# EAGLE schematic Modular_RFPA_RevA (EAGLE 6.6.0)
Assembly variants: IRF520N_20W, IRF630_200W

## Sheet 1 of 4: Push-pull power stage
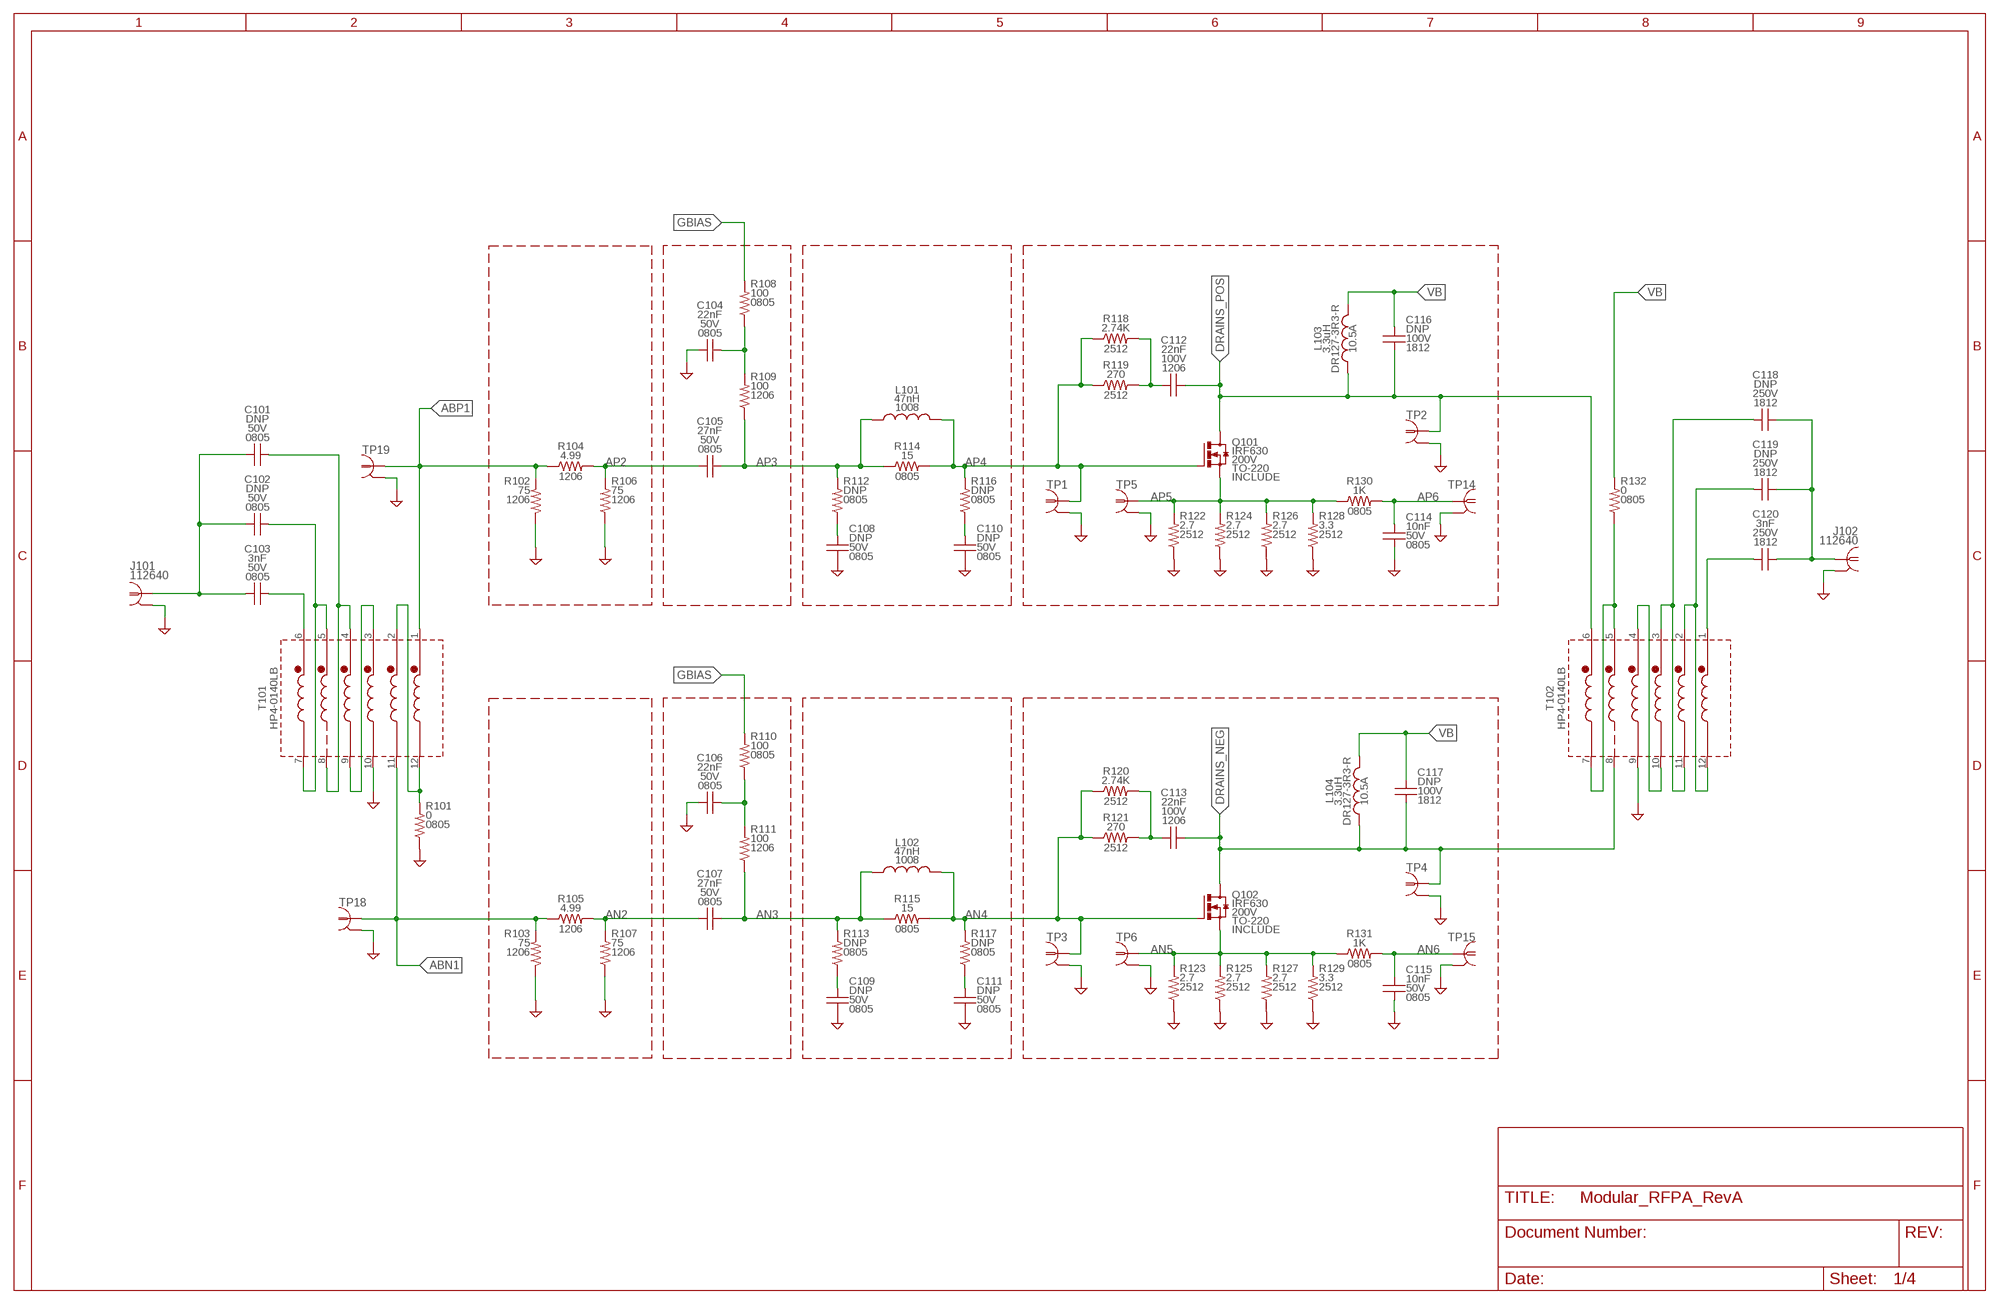
[diagram p0: schematic, sheet 1]

### Parts
C101  DNP  CGEN0805_IPC  [0805_IPC-7351B]  (not fitted in variant IRF630_200W)
C102  DNP  CGEN0805_IPC  [0805_IPC-7351B]  (not fitted in variant IRF520N_20W)  (not fitted in variant IRF630_200W)
C103  3nF  CGEN0805_IPC  [0805_IPC-7351B]  (not fitted in variant IRF520N_20W)
C104  22nF  CGEN0805_IPC  [0805_IPC-7351B]
C105  27nF  CGEN0805_IPC  [0805_IPC-7351B]
C106  22nF  CGEN0805_IPC  [0805_IPC-7351B]
C107  27nF  CGEN0805_IPC  [0805_IPC-7351B]
C108  DNP  CGEN0805_IPC  [0805_IPC-7351B]  (not fitted in variant IRF520N_20W)  (not fitted in variant IRF630_200W)
C109  DNP  CGEN0805_IPC  [0805_IPC-7351B]  (not fitted in variant IRF520N_20W)  (not fitted in variant IRF630_200W)
C110  DNP  CGEN0805_IPC  [0805_IPC-7351B]  (not fitted in variant IRF520N_20W)  (not fitted in variant IRF630_200W)
C111  DNP  CGEN0805_IPC  [0805_IPC-7351B]  (not fitted in variant IRF520N_20W)  (not fitted in variant IRF630_200W)
C112  22nF  CGENC1206  [C1206]
C113  22nF  CGENC1206  [C1206]
C114  10nF  CGEN0805_IPC  [0805_IPC-7351B]
C115  10nF  CGEN0805_IPC  [0805_IPC-7351B]
C116  DNP  CGENC1812  [C1812]
C117  DNP  CGENC1812  [C1812]
C118  DNP  CGENC1812  [C1812]  (not fitted in variant IRF630_200W)
C119  DNP  CGENC1812  [C1812]  (not fitted in variant IRF520N_20W)  (not fitted in variant IRF630_200W)
C120  3nF  CGENC1812  [C1812]  (not fitted in variant IRF520N_20W)  (variant IRF630_200W: 1.5nF)
J101  COAX112640BNC_EDGE  [BNC_EDGE]
J102  COAX112640BNC_EDGE  [BNC_EDGE]
L101  47nH  L_CHIPL-47N-AIR-5%-1008-1A1008  [L1008]
L102  47nH  L_CHIPL-47N-AIR-5%-1008-1A1008  [L1008]
L103  3.3uH  LL-3.3U-FERRITE-20%-12.5X12.5MM-10.5A  [DR127]  (variant IRF520N_20W: 22uH)
L104  3.3uH  LL-3.3U-FERRITE-20%-12.5X12.5MM-10.5A  [DR127]  (variant IRF520N_20W: 22uH)
Q101  IRF520N  MOSFET_NIRF630TO-220-VERT  [TO220BV]
Q102  IRF630  MOSFET_NIRF630TO-220-VERT  [TO220BV]
R101  0  RGEN0805_IPC  [0805_IPC-7351B]
R102  75  RGEN1206_IPC  [1206_IPC-7351B]
R103  75  RGEN1206_IPC  [1206_IPC-7351B]
R104  4.99  R90GEN1206_IPC  [1206_IPC-7351B]
R105  4.99  R90GEN1206_IPC  [1206_IPC-7351B]
R106  75  RGEN1206_IPC  [1206_IPC-7351B]
R107  75  RGEN1206_IPC  [1206_IPC-7351B]
R108  100  RGEN0805_IPC  [0805_IPC-7351B]
R109  100  RGEN1206_IPC  [1206_IPC-7351B]
R110  100  RGEN0805_IPC  [0805_IPC-7351B]
R111  100  RGEN1206_IPC  [1206_IPC-7351B]
R112  DNP  RGEN0805_IPC  [0805_IPC-7351B]  (not fitted in variant IRF520N_20W)  (not fitted in variant IRF630_200W)
R113  DNP  RGEN0805_IPC  [0805_IPC-7351B]  (not fitted in variant IRF520N_20W)  (not fitted in variant IRF630_200W)
R114  15  R90GEN0805_IPC  [0805_IPC-7351B]
R115  15  R90GEN0805_IPC  [0805_IPC-7351B]
R116  DNP  RGEN0805_IPC  [0805_IPC-7351B]  (not fitted in variant IRF520N_20W)  (not fitted in variant IRF630_200W)
R117  DNP  RGEN0805_IPC  [0805_IPC-7351B]  (not fitted in variant IRF520N_20W)  (not fitted in variant IRF630_200W)
R118  2.74K  R90GENR2512  [R2512]
R119  270  R90GENR2512  [R2512]
R120  2.74K  R90GENR2512  [R2512]
R121  270  R90GENR2512  [R2512]
R122  2.7  RGENR2512  [R2512]
R123  2.7  RGENR2512  [R2512]
R124  2.7  RGENR2512  [R2512]
R125  2.7  RGENR2512  [R2512]
R126  2.7  RGENR2512  [R2512]
R127  2.7  RGENR2512  [R2512]
R128  3.3  RGENR2512  [R2512]
R129  3.3  RGENR2512  [R2512]
R130  1K  R90GEN0805_IPC  [0805_IPC-7351B]
R131  1K  R90GEN0805_IPC  [0805_IPC-7351B]
R132  0  RGEN0805_IPC  [0805_IPC-7351B]
T101  HP4_TRAFO  [HP4]
T102  HP4_TRAFO  [HP4]
TP1  PROBE_TPTP_5MM  [PROBE_TP_5MM]
TP2  PROBE_TPTP_7P5MM  [PROBE_TP_7P5MM]
TP3  PROBE_TPTP_5MM  [PROBE_TP_5MM]
TP4  PROBE_TPTP_7P5MM  [PROBE_TP_7P5MM]
TP5  PROBE_TPTP_7P5MM  [PROBE_TP_7P5MM]
TP6  PROBE_TPTP_7P5MM  [PROBE_TP_7P5MM]
TP14  PROBE_TPTP_5MM  [PROBE_TP_5MM]
TP15  PROBE_TPTP_5MM  [PROBE_TP_5MM]
TP18  PROBE_TPTP_5MM  [PROBE_TP_5MM]
TP19  PROBE_TPTP_5MM  [PROBE_TP_5MM]

### Nets
ABN1: R103.1 R105.1 T101.11(F2) TP18.TP ; also sheet 2
ABP1: R102.1 R104.1 T101.1(S1) TP19.TP ; also sheet 2
AN2: C107.2 R105.2 R107.1
AN3: C107.1 L102.1 R111.2 R113.1 R115.1
AN4: L102.2 Q102.G R115.2 R117.1 R120.1 R121.1 TP3.TP
AN5: Q102.S R123.1 R125.1 R127.1 R129.1 R131.1 TP6.TP
AN6: C115.1 R131.2 TP15.TP
AP2: C105.2 R104.2 R106.1
AP3: C105.1 L101.1 R109.2 R112.1 R114.1
AP4: L101.2 Q101.G R114.2 R116.1 R118.1 R119.1 TP1.TP
AP5: Q101.S R122.1 R124.1 R126.1 R128.1 R130.1 TP5.TP
AP6: C114.1 R130.2 TP14.TP
DRAINS_NEG [32W_20S]: C113.2 C117.2 L104.1 Q102.D T102.8(F5) TP4.TP ; also sheet 2
DRAINS_POS [32W_30S]: C112.2 C116.2 L103.1 Q101.D T102.6(S6) TP2.TP ; also sheet 2
GBIAS: R108.1 R110.1 ; also sheet 2,3
GND: C104.2 C106.2 C108.2 C109.2 C110.2 C111.2 C114.2 C115.2 J101.G1(GND1) J101.G2(GND1) J101.G3(GND1) J101.G4(GND1) J102.G1(GND1) J102.G2(GND1) J102.G3(GND1) J102.G4(GND1) R101.2 R102.2 R103.2 R106.2 R107.2 R122.2 R123.2 R124.2 R125.2 R126.2 R127.2 R128.2 R129.2 T101.10(F3) T102.9(F4) TP1.GND(GND1) TP2.GND(GND1) TP3.GND(GND1) TP4.GND(GND1) TP5.GND(GND1) TP6.GND(GND1) TP14.GND(GND1) TP15.GND(GND1) TP18.GND(GND1) TP19.GND(GND1) ; also sheet 2,3,4
N$4: C113.1 R120.2 R121.2
N$5: C109.1 R113.2
N$8: C104.1 R108.2 R109.1
N$10: C108.1 R112.2
N$11: C110.1 R116.2
N$12: C112.1 R118.2 R119.2
N$13: C106.1 R110.2 R111.1
N$17: C111.1 R117.2
N$22: T101.3(S3) T101.9(F4)
N$27: R101.1 T101.2(S2) T101.12(F1)
N$29 [32W_30S]: C119.1 T102.2(S2) T102.12(F1)
N$30 [32W_30S]: C120.1 T102.1(S1)
N$31 [32W_30S]: C118.2 C119.2 C120.2 J102.C
N$34: C101.2 C102.2 C103.2 J101.C
N$41: C103.1 T101.6(S6)
N$52 [32W_30S]: C118.1 T102.3(S3) T102.11(F2)
N$57: C101.1 T101.4(S4) T101.8(F5)
N$58 [32W_30S]: T102.4(S4) T102.10(F3)
VB [50W_30S]: C116.1 C117.1 L103.2 L104.2 R132.1 ; also sheet 4
VB_CT [32W_30S]: R132.2 T102.5(S5) T102.7(F6)
VB_CT1: C102.1 T101.5(S5) T101.7(F6)

## Sheet 2 of 4: Parallel copy of push-pull power stage
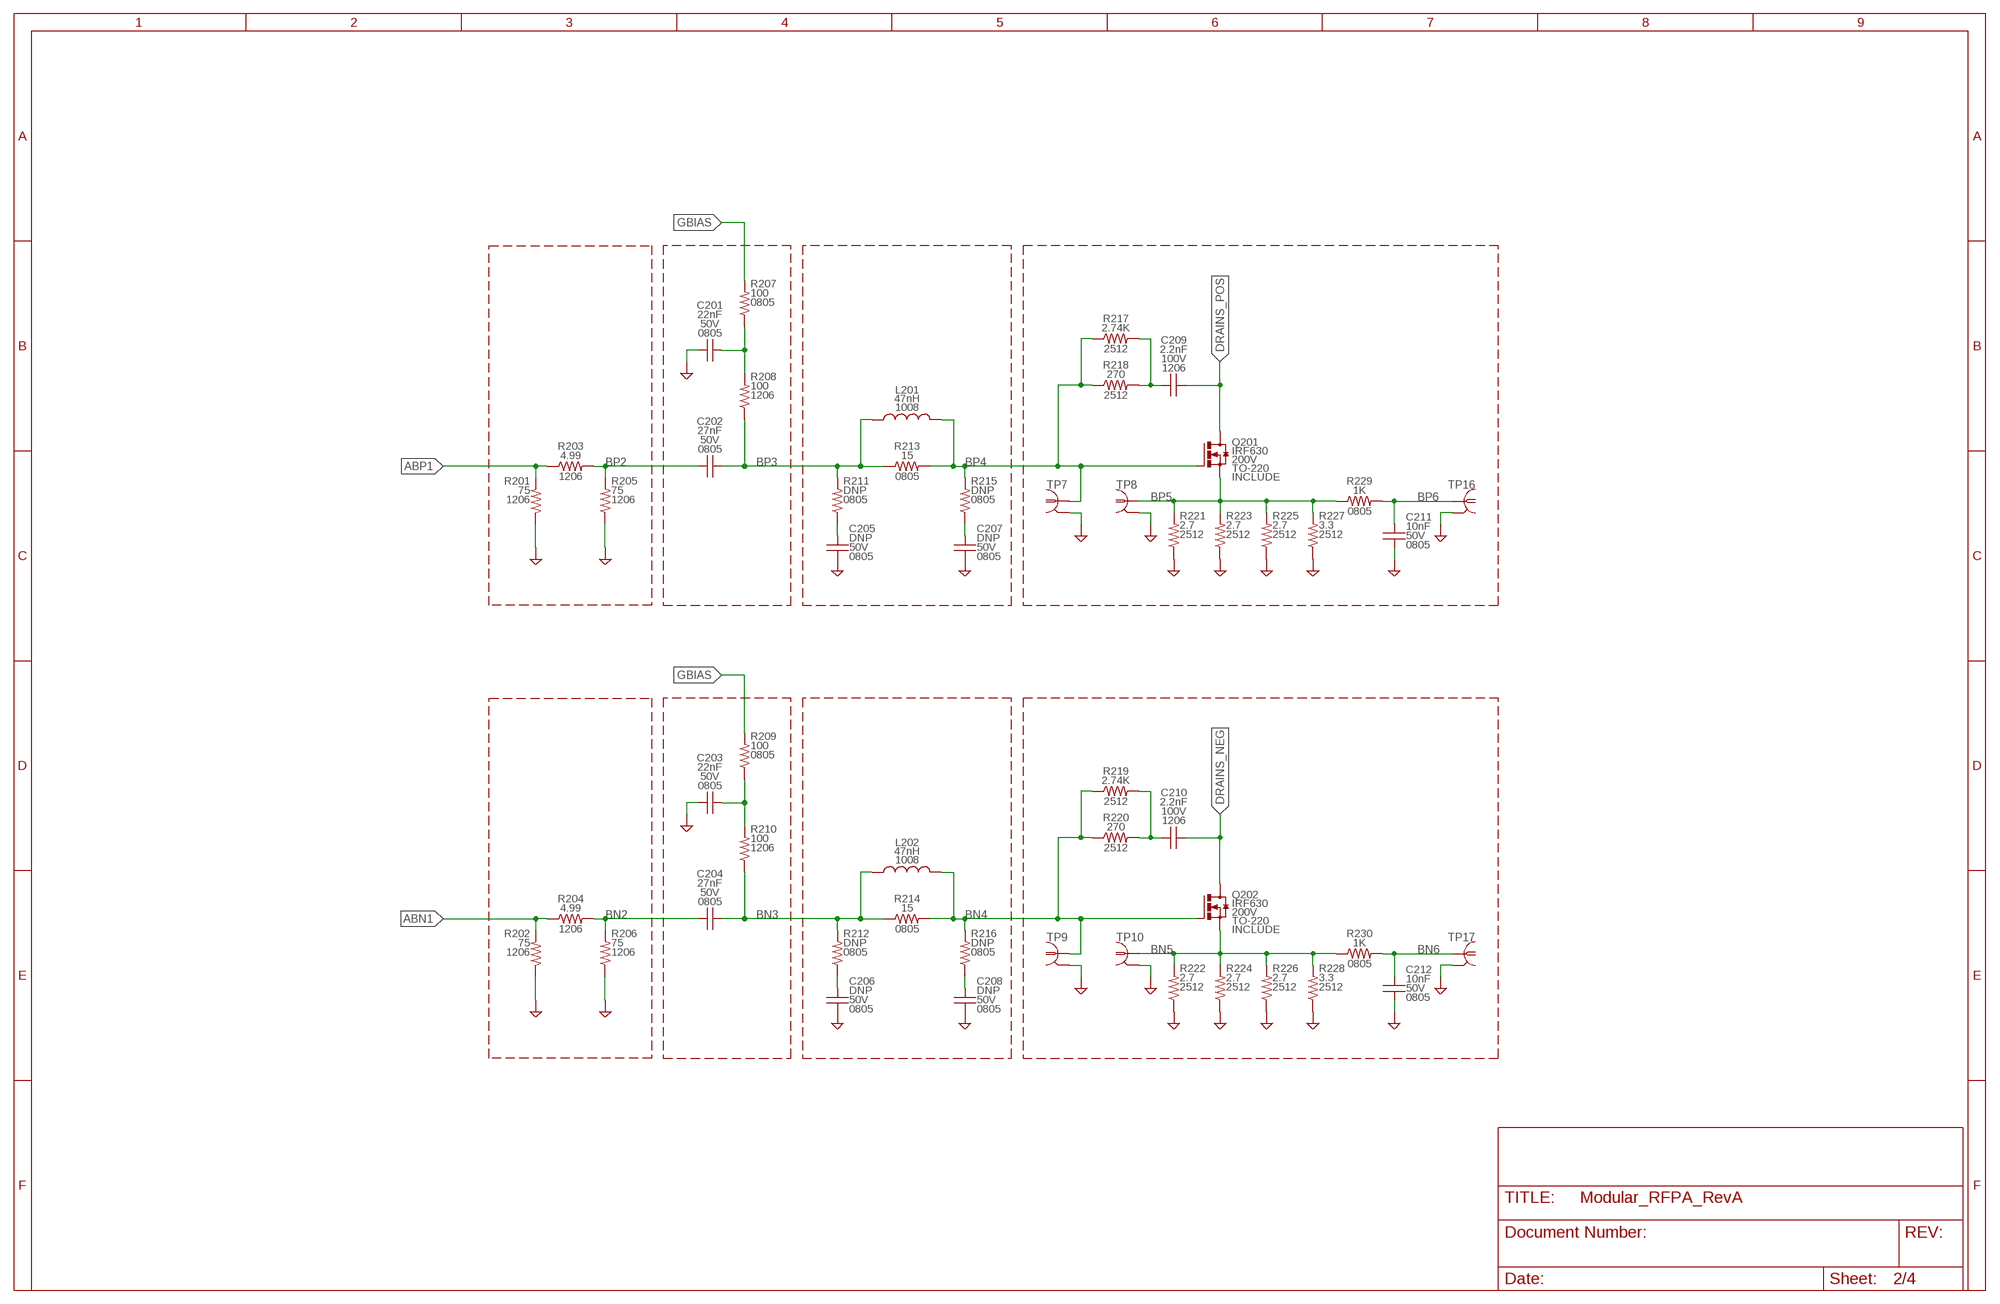
[diagram p1: schematic, sheet 2]

### Parts
C201  22nF  CGEN0805_IPC  [0805_IPC-7351B]  (not fitted in variant IRF520N_20W)
C202  27nF  CGEN0805_IPC  [0805_IPC-7351B]  (not fitted in variant IRF520N_20W)
C203  22nF  CGEN0805_IPC  [0805_IPC-7351B]  (not fitted in variant IRF520N_20W)
C204  27nF  CGEN0805_IPC  [0805_IPC-7351B]  (not fitted in variant IRF520N_20W)
C205  DNP  CGEN0805_IPC  [0805_IPC-7351B]  (not fitted in variant IRF520N_20W)  (not fitted in variant IRF630_200W)
C206  DNP  CGEN0805_IPC  [0805_IPC-7351B]  (not fitted in variant IRF520N_20W)  (not fitted in variant IRF630_200W)
C207  DNP  CGEN0805_IPC  [0805_IPC-7351B]  (not fitted in variant IRF520N_20W)  (not fitted in variant IRF630_200W)
C208  DNP  CGEN0805_IPC  [0805_IPC-7351B]  (not fitted in variant IRF520N_20W)  (not fitted in variant IRF630_200W)
C209  2.2nF  CGENC1206  [C1206]  (not fitted in variant IRF520N_20W)
C210  2.2nF  CGENC1206  [C1206]  (not fitted in variant IRF520N_20W)
C211  10nF  CGEN0805_IPC  [0805_IPC-7351B]  (not fitted in variant IRF520N_20W)
C212  10nF  CGEN0805_IPC  [0805_IPC-7351B]  (not fitted in variant IRF520N_20W)
L201  47nH  L_CHIPL-47N-AIR-5%-1008-1A1008  [L1008]  (not fitted in variant IRF520N_20W)
L202  47nH  L_CHIPL-47N-AIR-5%-1008-1A1008  [L1008]  (not fitted in variant IRF520N_20W)
Q201  IRF630  MOSFET_NIRF630TO-220-VERT  [TO220BV]  (not fitted in variant IRF520N_20W)
Q202  IRF630  MOSFET_NIRF630TO-220-VERT  [TO220BV]  (not fitted in variant IRF520N_20W)
R201  75  RGEN1206_IPC  [1206_IPC-7351B]  (not fitted in variant IRF520N_20W)
R202  75  RGEN1206_IPC  [1206_IPC-7351B]  (not fitted in variant IRF520N_20W)
R203  4.99  R90GEN1206_IPC  [1206_IPC-7351B]  (not fitted in variant IRF520N_20W)
R204  4.99  R90GEN1206_IPC  [1206_IPC-7351B]  (not fitted in variant IRF520N_20W)
R205  75  RGEN1206_IPC  [1206_IPC-7351B]  (not fitted in variant IRF520N_20W)
R206  75  RGEN1206_IPC  [1206_IPC-7351B]  (not fitted in variant IRF520N_20W)
R207  100  RGEN0805_IPC  [0805_IPC-7351B]  (not fitted in variant IRF520N_20W)
R208  100  RGEN1206_IPC  [1206_IPC-7351B]  (not fitted in variant IRF520N_20W)
R209  100  RGEN0805_IPC  [0805_IPC-7351B]  (not fitted in variant IRF520N_20W)
R210  100  RGEN1206_IPC  [1206_IPC-7351B]  (not fitted in variant IRF520N_20W)
R211  DNP  RGEN0805_IPC  [0805_IPC-7351B]  (not fitted in variant IRF520N_20W)  (not fitted in variant IRF630_200W)
R212  DNP  RGEN0805_IPC  [0805_IPC-7351B]  (not fitted in variant IRF520N_20W)  (not fitted in variant IRF630_200W)
R213  15  R90GEN0805_IPC  [0805_IPC-7351B]  (not fitted in variant IRF520N_20W)
R214  15  R90GEN0805_IPC  [0805_IPC-7351B]  (not fitted in variant IRF520N_20W)
R215  DNP  RGEN0805_IPC  [0805_IPC-7351B]  (not fitted in variant IRF520N_20W)  (not fitted in variant IRF630_200W)
R216  DNP  RGEN0805_IPC  [0805_IPC-7351B]  (not fitted in variant IRF520N_20W)  (not fitted in variant IRF630_200W)
R217  2.74K  R90GENR2512  [R2512]  (not fitted in variant IRF520N_20W)
R218  270  R90GENR2512  [R2512]  (not fitted in variant IRF520N_20W)
R219  2.74K  R90GENR2512  [R2512]  (not fitted in variant IRF520N_20W)
R220  270  R90GENR2512  [R2512]  (not fitted in variant IRF520N_20W)
R221  2.7  RGENR2512  [R2512]  (not fitted in variant IRF520N_20W)
R222  2.7  RGENR2512  [R2512]  (not fitted in variant IRF520N_20W)
R223  2.7  RGENR2512  [R2512]  (not fitted in variant IRF520N_20W)
R224  2.7  RGENR2512  [R2512]  (not fitted in variant IRF520N_20W)
R225  2.7  RGENR2512  [R2512]  (not fitted in variant IRF520N_20W)
R226  2.7  RGENR2512  [R2512]  (not fitted in variant IRF520N_20W)
R227  3.3  RGENR2512  [R2512]  (not fitted in variant IRF520N_20W)
R228  3.3  RGENR2512  [R2512]  (not fitted in variant IRF520N_20W)
R229  1K  R90GEN0805_IPC  [0805_IPC-7351B]  (not fitted in variant IRF520N_20W)
R230  1K  R90GEN0805_IPC  [0805_IPC-7351B]  (not fitted in variant IRF520N_20W)
TP7  PROBE_TPTP_5MM  [PROBE_TP_5MM]
TP8  PROBE_TPTP_7P5MM  [PROBE_TP_7P5MM]
TP9  PROBE_TPTP_5MM  [PROBE_TP_5MM]
TP10  PROBE_TPTP_5MM  [PROBE_TP_5MM]
TP16  PROBE_TPTP_5MM  [PROBE_TP_5MM]
TP17  PROBE_TPTP_7P5MM  [PROBE_TP_7P5MM]

### Nets
ABN1: R202.1 R204.1 ; also sheet 1
ABP1: R201.1 R203.1 ; also sheet 1
BN2: C204.2 R204.2 R206.1
BN3: C204.1 L202.1 R210.2 R212.1 R214.1
BN4: L202.2 Q202.G R214.2 R216.1 R219.1 R220.1 TP9.TP
BN5: Q202.S R222.1 R224.1 R226.1 R228.1 R230.1 TP10.TP
BN6: C212.1 R230.2 TP17.TP
BP2: C202.2 R203.2 R205.1
BP3: C202.1 L201.1 R208.2 R211.1 R213.1
BP4: L201.2 Q201.G R213.2 R215.1 R217.1 R218.1 TP7.TP
BP5: Q201.S R221.1 R223.1 R225.1 R227.1 R229.1 TP8.TP
BP6: C211.1 R229.2 TP16.TP
DRAINS_NEG [32W_20S]: C210.2 Q202.D ; also sheet 1
DRAINS_POS [32W_30S]: C209.2 Q201.D ; also sheet 1
GBIAS: R207.1 R209.1 ; also sheet 1,3
GND: C201.2 C203.2 C205.2 C206.2 C207.2 C208.2 C211.2 C212.2 R201.2 R202.2 R205.2 R206.2 R221.2 R222.2 R223.2 R224.2 R225.2 R226.2 R227.2 R228.2 TP7.GND(GND1) TP8.GND(GND1) TP9.GND(GND1) TP10.GND(GND1) TP16.GND(GND1) TP17.GND(GND1) ; also sheet 1,3,4
N$35: C203.1 R209.2 R210.1
N$36: C206.1 R212.2
N$38: C208.1 R216.2
N$39: C210.1 R219.2 R220.2
N$40: C201.1 R207.2 R208.1
N$42: C205.1 R211.2
N$48: C207.1 R215.2
N$50: C209.1 R217.2 R218.2

## Sheet 3 of 4: Gate bias driver
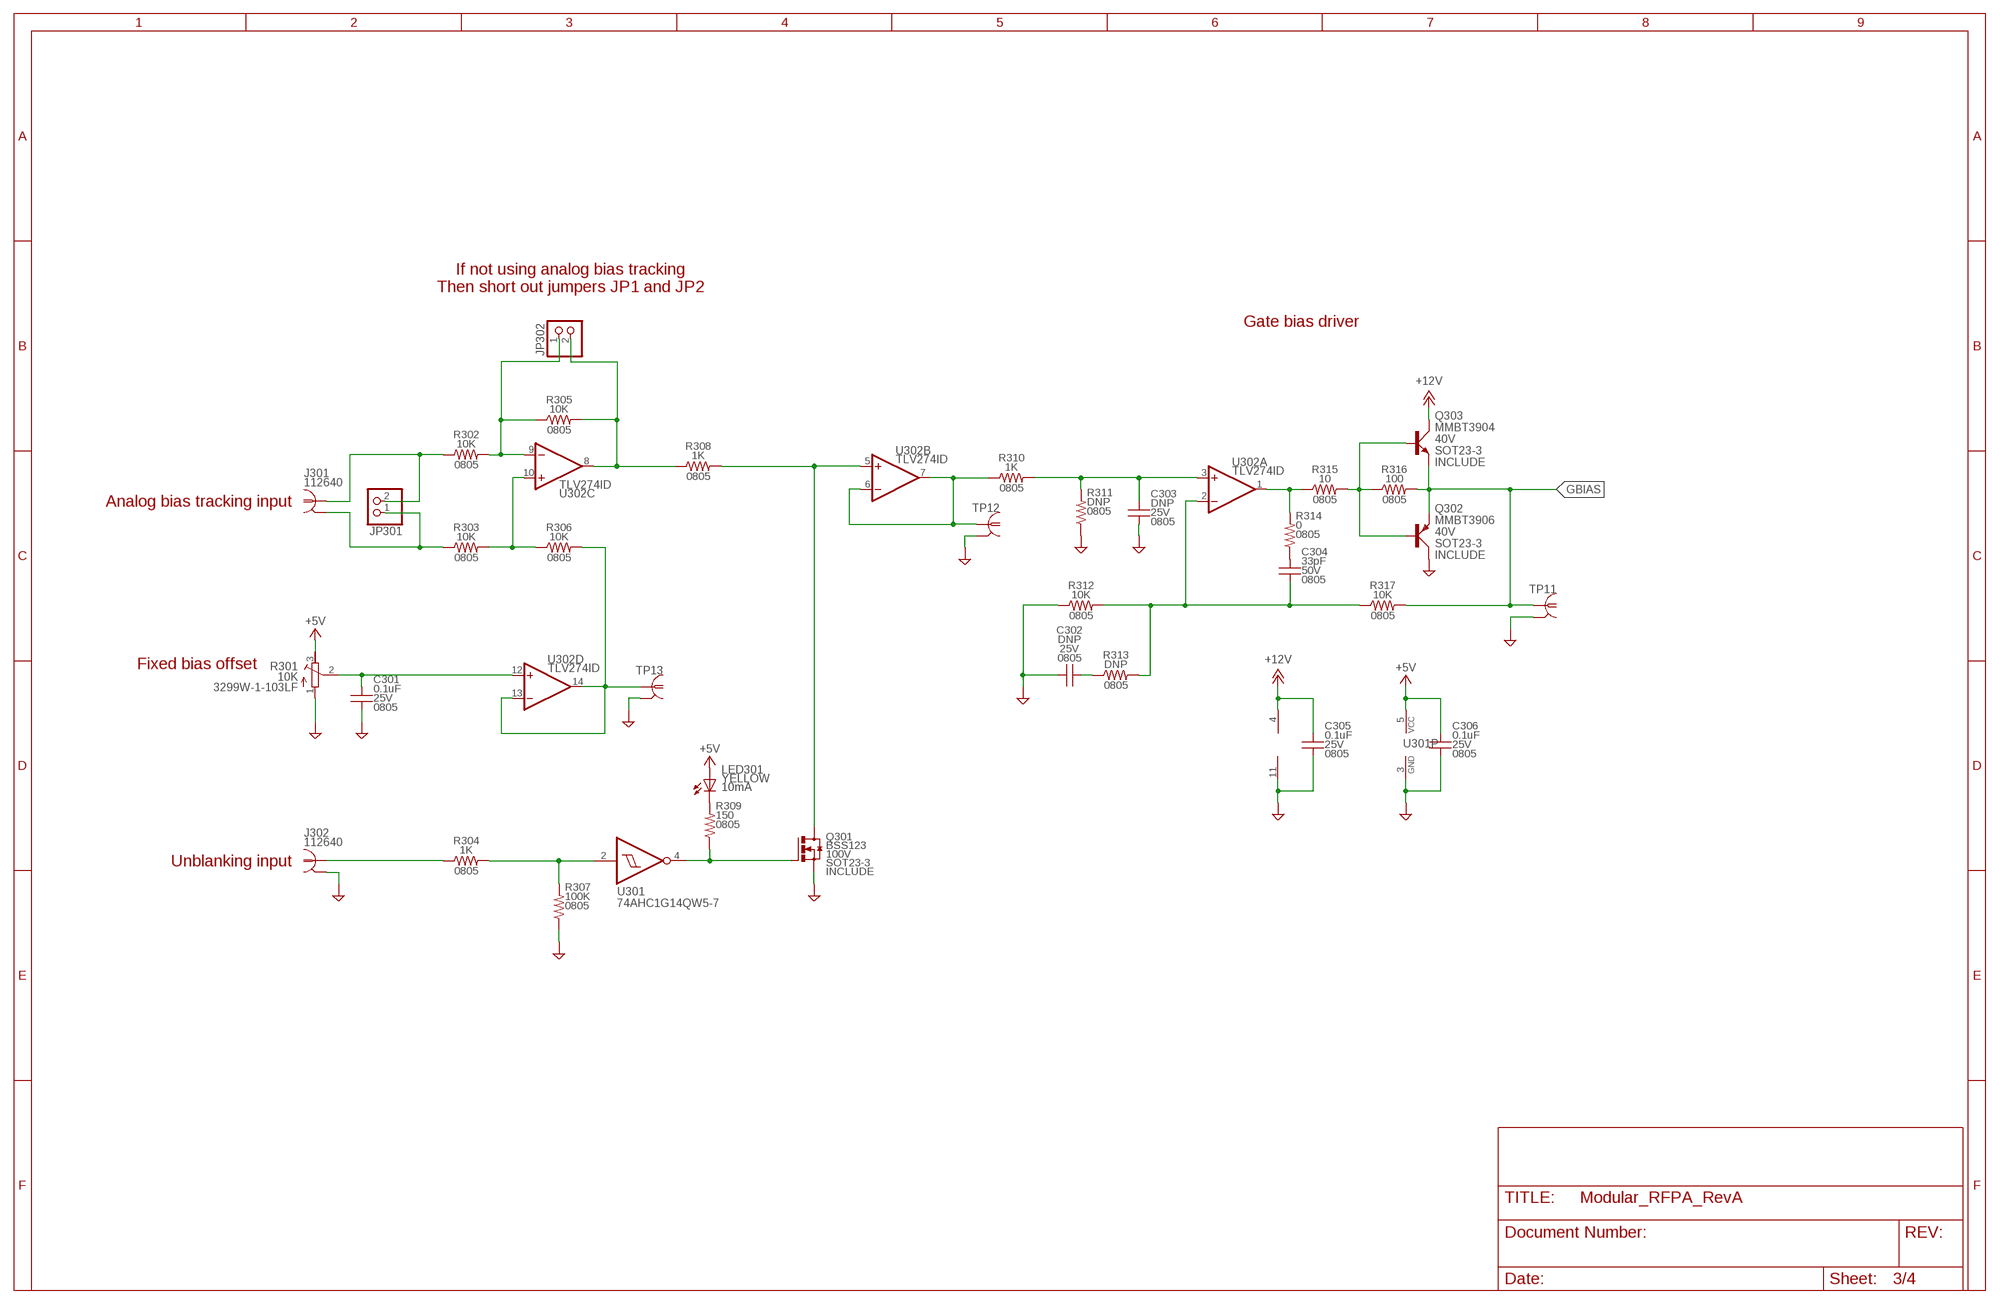
[diagram p2: schematic, sheet 3]

### Parts
C301  0.1uF  CGEN0805_IPC  [0805_IPC-7351B]
C302  DNP  CGEN0805_IPC  [0805_IPC-7351B]  (not fitted in variant IRF520N_20W)  (not fitted in variant IRF630_200W)
C303  DNP  CGEN0805_IPC  [0805_IPC-7351B]  (not fitted in variant IRF520N_20W)  (not fitted in variant IRF630_200W)
C304  33pF  CGEN0805_IPC  [0805_IPC-7351B]
C305  0.1uF  CGEN0805_IPC  [0805_IPC-7351B]
C306  0.1uF  CGEN0805_IPC  [0805_IPC-7351B]
J301  COAX112640BNC_EDGE  [BNC_EDGE]
J302  COAX112640BNC_EDGE  [BNC_EDGE]
JP301  PINHD-1X2  [1X02]
JP302  PINHD-1X2  [1X02]
LED301  LEDHLMP-3401-E0002T1_3/4  [LED5MM]
Q301  MOSFET_NBSS123SOT23  [SOT23R_INFINEON]
Q302  PNPSOT23_BEC  [SOT23R_INFINEON]
Q303  NPNMMBT3904SOT23_BEC  [SOT23R_INFINEON]
R301  10K  RTRIMRTRIM-10K-10%-3299W-0.5W3299W  [RTRIM3299W]
R302  10K  R90GEN0805_IPC  [0805_IPC-7351B]
R303  10K  R90GEN0805_IPC  [0805_IPC-7351B]
R304  1K  R90GEN0805_IPC  [0805_IPC-7351B]
R305  10K  R90GEN0805_IPC  [0805_IPC-7351B]
R306  10K  R90GEN0805_IPC  [0805_IPC-7351B]
R307  100K  RGEN0805_IPC  [0805_IPC-7351B]
R308  1K  R90GEN0805_IPC  [0805_IPC-7351B]
R309  150  RGEN0805_IPC  [0805_IPC-7351B]
R310  1K  R90GEN0805_IPC  [0805_IPC-7351B]
R311  DNP  RGEN0805_IPC  [0805_IPC-7351B]  (not fitted in variant IRF520N_20W)  (not fitted in variant IRF630_200W)
R312  10K  R90GEN0805_IPC  [0805_IPC-7351B]
R313  DNP  R90GEN0805_IPC  [0805_IPC-7351B]  (not fitted in variant IRF520N_20W)  (not fitted in variant IRF630_200W)
R314  0  RGEN0805_IPC  [0805_IPC-7351B]
R315  10  R90GEN0805_IPC  [0805_IPC-7351B]
R316  100  R90GEN0805_IPC  [0805_IPC-7351B]
R317  10K  R90GEN0805_IPC  [0805_IPC-7351B]
TP11  PROBE_TPTP_5MM  [PROBE_TP_5MM]
TP12  PROBE_TPTP_5MM  [PROBE_TP_5MM]
TP13  PROBE_TPTP_5MM  [PROBE_TP_5MM]
U301  74AHC1G14DBV  [SOT23-5]
U302  OPAMP_QUADTLV274IDSOIC14  [SO14]

### Nets
+5V: C306.1 LED301.A R301.3(E) U301.5(VCC) ; also sheet 4
+12V: C305.1 Q303.3(C) U302.4(P:V+) ; also sheet 4
GBIAS: Q302.2(E) Q303.2(E) R316.2 R317.2 TP11.TP ; also sheet 1,2
GND: C301.2 C302.2 C303.2 C305.2 C306.2 J302.G1(GND1) J302.G2(GND1) J302.G3(GND1) J302.G4(GND1) Q301.2(S) Q302.3(C) R301.1(A) R307.2 R311.2 R312.1 TP11.GND(GND1) TP12.GND(GND1) TP13.GND(GND1) U301.3(GND) U302.11(P:V-) ; also sheet 1,2,4
N$1: R314.1 R315.1 U302.1(A:OUT)
N$2: Q302.1(B) Q303.1(B) R315.2 R316.1
N$3: R304.2 R307.1 U301.2(I)
N$6: R310.1 TP12.TP U302.6(B:-IN) U302.7(B:OUT)
N$7: C304.1 R314.2
N$9: C302.1 R313.1
N$14: C304.2 R312.2 R313.2 R317.1 U302.2(A:-IN)
N$15: C303.1 R310.2 R311.1 U302.3(A:+IN)
N$16: R303.2 R306.1 U302.10(C:+IN)
N$18: JP302.2 R305.2 R308.1 U302.8(C:OUT)
N$19: JP302.1 R302.2 R305.1 U302.9(C:-IN)
N$20: J301.C JP301.2 R302.1
N$21: J301.G1(GND1) J301.G2(GND1) J301.G3(GND1) J301.G4(GND1) JP301.1 R303.1
N$23: Q301.3(D) R308.2 U302.5(B:+IN)
N$24: Q301.1(G) R309.2 U301.4(O)
N$25: C301.1 R301.2(S) U302.12(D:+IN)
N$26: R306.2 TP13.TP U302.13(D:-IN) U302.14(D:OUT)
N$37: LED301.K(C) R309.1
N$53: J302.C R304.1

### Notes on the sheet
- If not using analog bias tracking
  Then short out jumpers JP1 and JP2
- Gate bias driver
- Analog bias tracking input
- Fixed bias offset
- Unblanking input

## Sheet 4 of 4: Power entry
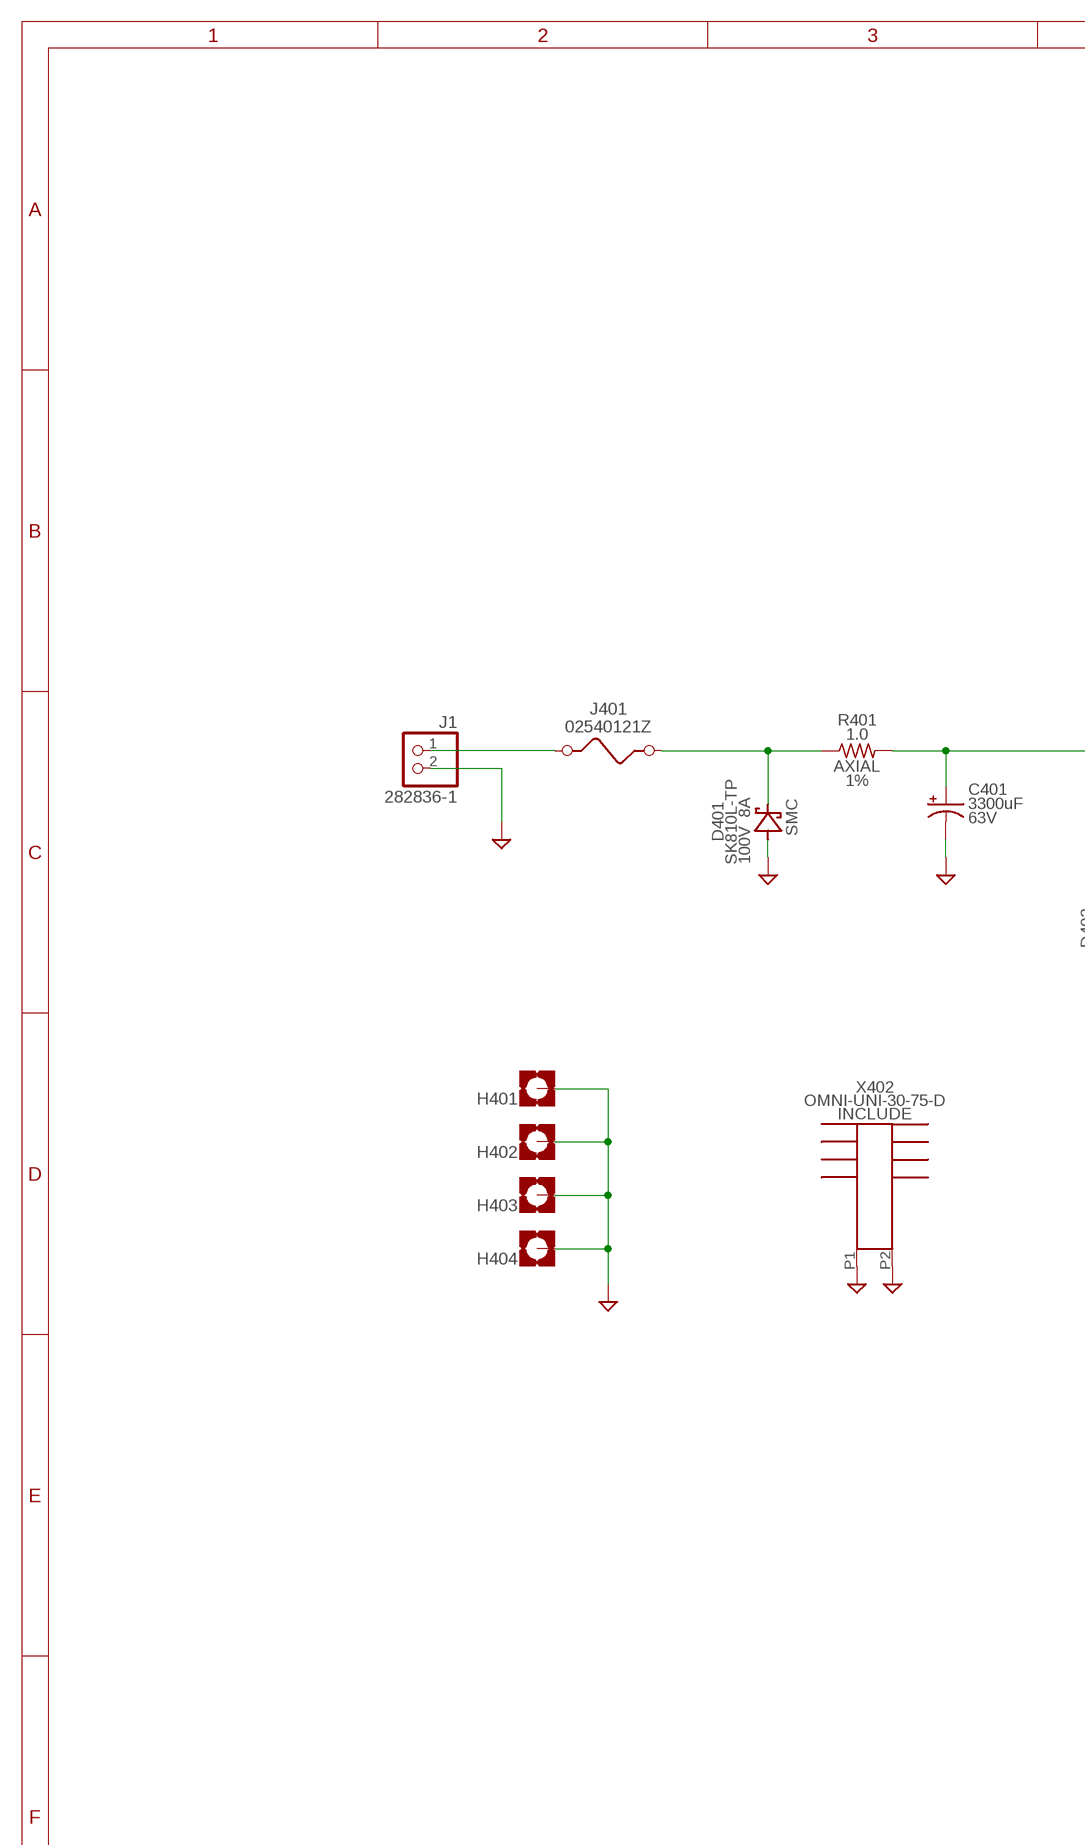
[diagram p3: schematic, sheet 4, part 1 of 2]
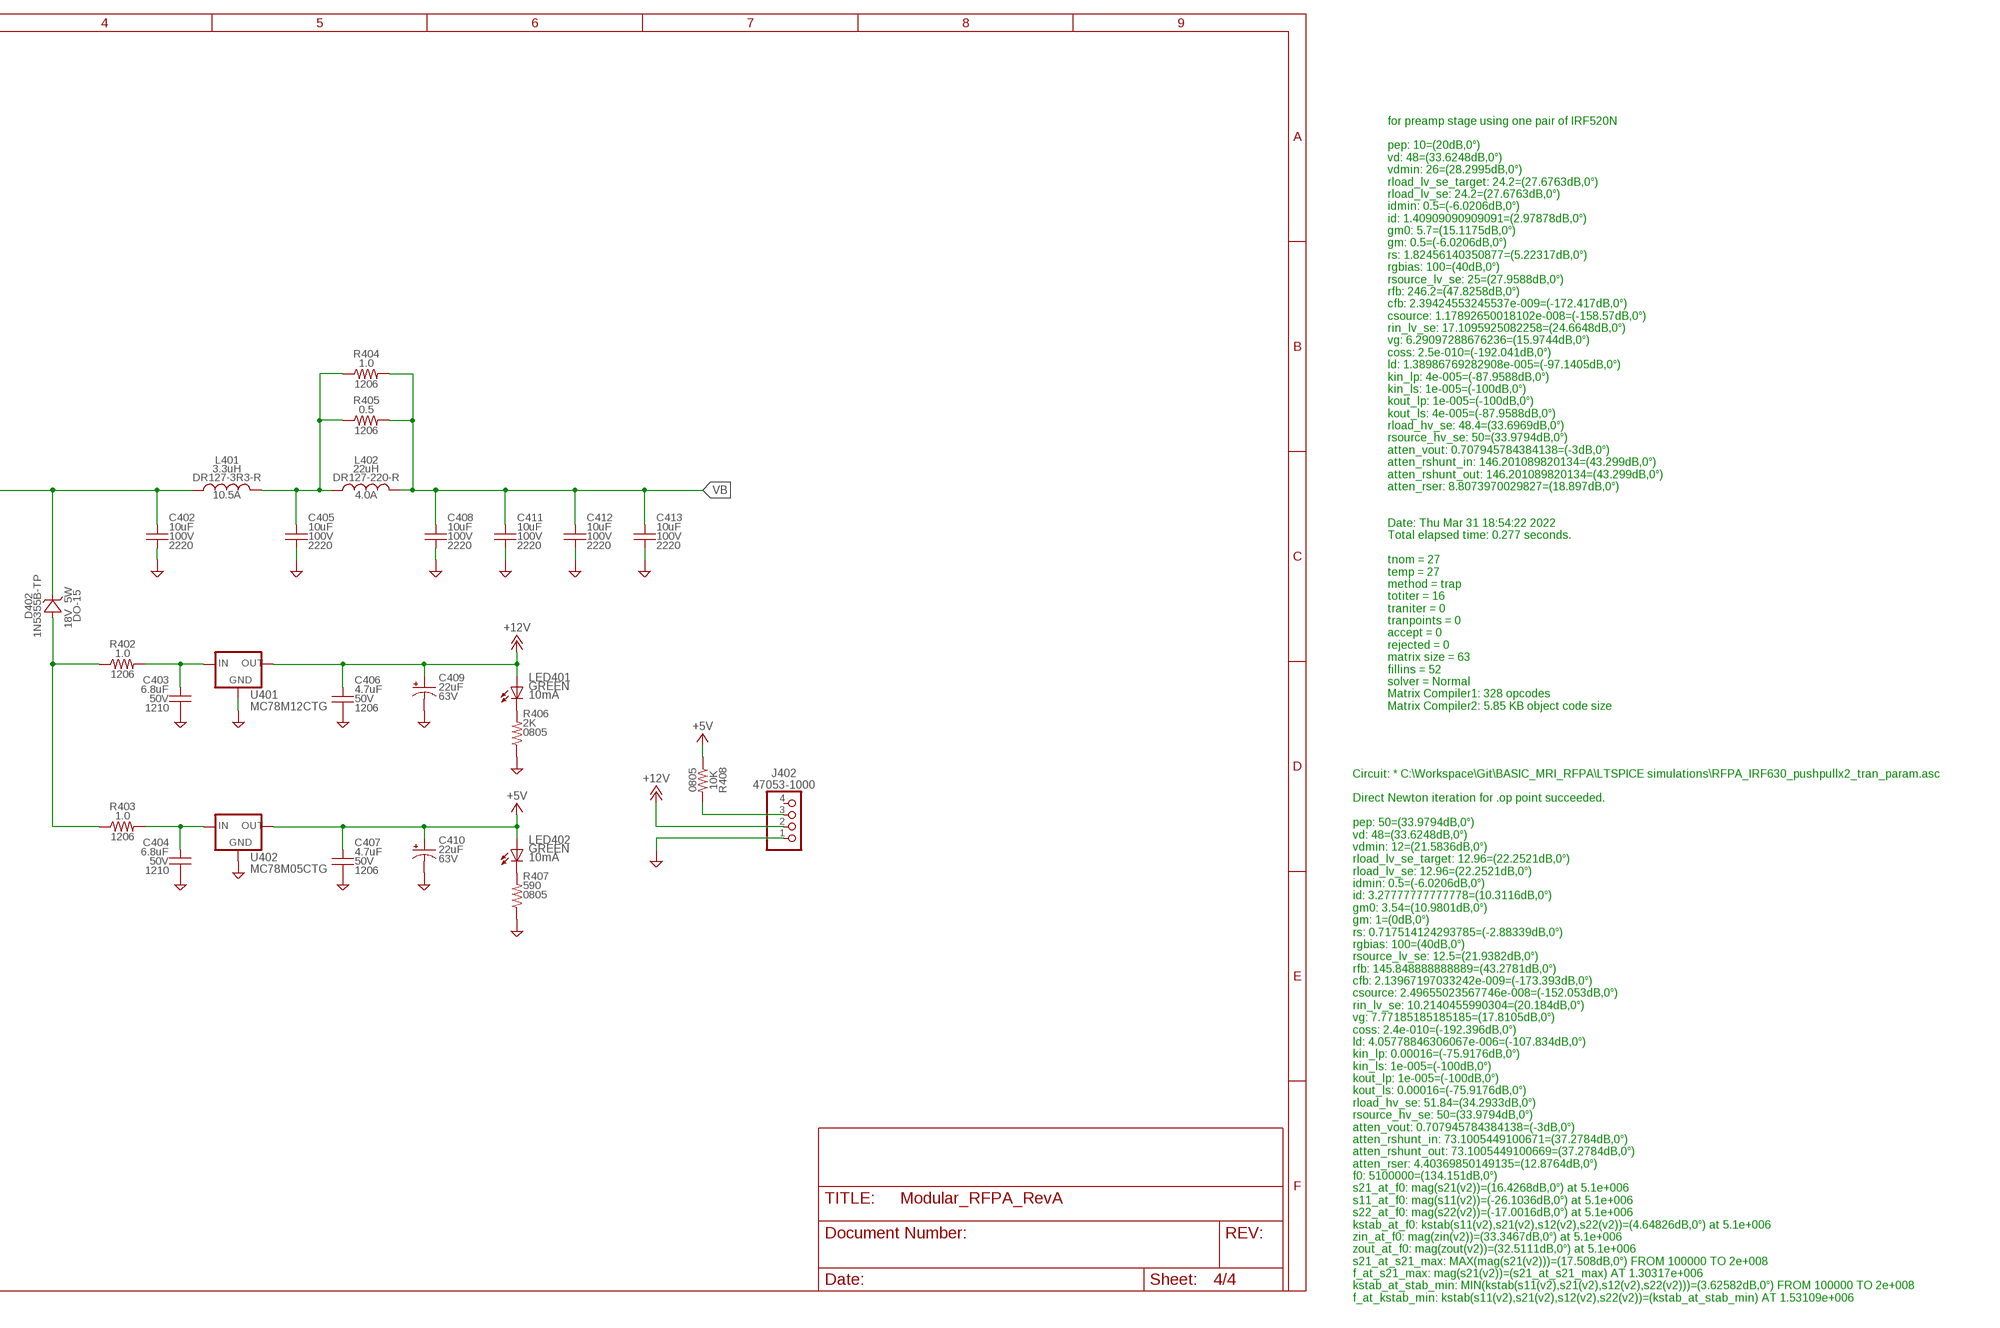
[diagram p4: schematic, sheet 4, part 2 of 2]

### Parts
C401  3300uF  CPOLC-3300U-63V-20%-25DX37L-ELECEB25D  [EB25D]
C402  10uF  CCC-10U-100V-20%-2220-X7TC2220_CKG57N  [C2220_CKG57N]
C403  6.8uF  CGENC1210  [C1210]
C404  6.8uF  CGENC1210  [C1210]
C405  10uF  CCC-10U-100V-20%-2220-X7TC2220_CKG57N  [C2220_CKG57N]
C406  4.7uF  CGENC1206  [C1206]
C407  4.7uF  CGENC1206  [C1206]
C408  10uF  CCC-10U-100V-20%-2220-X7TC2220_CKG57N  [C2220_CKG57N]
C409  22uF  CPOLC-22U-63V-20%-6.3DX12.5L-ELECE2,5-7  [E2,5-7]
C410  22uF  CPOLC-22U-63V-20%-6.3DX12.5L-ELECE2,5-7  [E2,5-7]
C411  10uF  CCC-10U-100V-20%-2220-X7TC2220_CKG57N  [C2220_CKG57N]
C412  10uF  CCC-10U-100V-20%-2220-X7TC2220_CKG57N  [C2220_CKG57N]
C413  10uF  CCC-10U-100V-20%-2220-X7TC2220_CKG57N  [C2220_CKG57N]
D401  D-SCHOTTKYSK810L-TPSMC  [DO-214AB(SMC)]
D402  D-ZENER1N5355B-TPDO15-12  [DO15-12]
H401  MOUNT-PAD-SQUARE3.2  [3,2-PAD-SQUARE]
H402  MOUNT-PAD-SQUARE3.2  [3,2-PAD-SQUARE]
H403  MOUNT-PAD-SQUARE3.2  [3,2-PAD-SQUARE]
H404  MOUNT-PAD-SQUARE3.2  [3,2-PAD-SQUARE]
J1  HDR_2X1282836-1282836-1  [W237-02]
J401  FUSE_2P  [02540121Z]
J402  KK_PCFAN  [47053-1000]
L401  3.3uH  LL-3.3U-FERRITE-20%-12.5X12.5MM-10.5A  [DR127]
L402  22uH  LL-22U-FERRITE-20%-12.5X12.5MM-4A  [DR127]
LED401  LEDHLMP-3962-F0002T1_3/4  [LED5MM]
LED402  LEDHLMP-3962-F0002T1_3/4  [LED5MM]
R401  1.0  R90R-1.0-1%-AXIAL-3WP0817V  [P0817V]
R402  1.0  R90GENR1206  [R1206]
R403  1.0  R90GENR1206  [R1206]
R404  1.0  R90GEN1206_IPC  [1206_IPC-7351B]
R405  0.5  R90GEN1206_IPC  [1206_IPC-7351B]
R406  2K  RGEN0805_IPC  [0805_IPC-7351B]
R407  590  RGEN0805_IPC  [0805_IPC-7351B]
R408  10K  R90GEN0805_IPC  [0805_IPC-7351B]
U401  LDO_3TERMMC78M12CTGTO220_VERT  [TO220BV]
U402  LDO_3TERMMC78M05CTGTO220_VERT  [TO220BV]
X402  HEATSINK_OMNI_DUALOMNI-UNI-30-75-D30-75-D  [OMNI-UNI-30-75-D]

### Nets
+5V: C407.1 C410.+ LED402.A R408.1 U402.3(OUT) ; also sheet 3
+12V: C406.1 C409.+ J402.2 LED401.A U401.3(OUT) ; also sheet 3
GND: C401.- C402.2 C403.2 C404.2 C405.2 C406.2 C407.2 C408.2 C409.- C410.- C411.2 C412.2 C413.2 D401.A(A1) H401.B3,2(MOUNT) H402.B3,2(MOUNT) H403.B3,2(MOUNT) H404.B3,2(MOUNT) J1.2 J402.1 R406.2 R407.2 U401.2(GND) U402.2(GND) X402.P1 X402.P2 ; also sheet 1,2,3
N$28: D402.A(A1) R402.1 R403.1
N$32: LED401.K(C) R406.1
N$33: LED402.K(C) R407.1
N$43: C403.1 R402.2 U401.1(IN)
N$44: D401.K(C1) J401.2 R401.1
N$45: J1.1 J401.1
N$46: C401.+ C402.1 D402.C(C1) L401.1 R401.2
N$47 [32W_30S]: C405.1 L401.2 L402.1 R404.1 R405.1
N$49: C404.1 R403.2 U402.1(IN)
N$51: J402.3 R408.2
VB [50W_30S]: C408.1 C411.1 C412.1 C413.1 L402.2 R404.2 R405.2 ; also sheet 1
Unconnected: J402.4

### Notes on the sheet
- for preamp stage using one pair of IRF520N
  
  pep: 10=(20dB,0°)
  vd: 48=(33.6248dB,0°)
  vdmin: 26=(28.2995dB,0°)
  rload_lv_se_target: 24.2=(27.6763dB,0°)
  rload_lv_se: 24.2=(27.6763dB,0°)
  idmin: 0.5=(-6.0206dB,0°)
  id: 1.40909090909091=(2.97878dB,0°)
  gm0: 5.7=(15.1175dB,0°)
  gm: 0.5=(-6.0206dB,0°)
  rs: 1.82456140350877=(5.22317dB,0°)
  rgbias: 100=(40dB,0°)
  rsource_lv_se: 25=(27.9588dB,0°)
  rfb: 246.2=(47.8258dB,0°)
  cfb: 2.39424553245537e-009=(-172.417dB,0°)
  csource: 1.17892650018102e-008=(-158.57dB,0°)
  rin_lv_se: 17.1095925082258=(24.6648dB,0°)
  vg: 6.29097288676236=(15.9744dB,0°)
  coss: 2.5e-010=(-192.041dB,0°)
  ld: 1.38986769282908e-005=(-97.1405dB,0°)
  kin_lp: 4e-005=(-87.9588dB,0°)
  kin_ls: 1e-005=(-100dB,0°)
  kout_lp: 1e-005=(-100dB,0°)
  kout_ls: 4e-005=(-87.9588dB,0°)
  rload_hv_se: 48.4=(33.6969dB,0°)
  rsource_hv_se: 50=(33.9794dB,0°)
  atten_vout: 0.707945784384138=(-3dB,0°)
  atten_rshunt_in: 146.201089820134=(43.299dB,0°)
  atten_rshunt_out: 146.201089820134=(43.299dB,0°)
  atten_rser: 8.8073970029827=(18.897dB,0°)
  
  
  Date: Thu Mar 31 18:54:22 2022
  Total elapsed time: 0.277 seconds.
  
  tnom = 27
  temp = 27
  method = trap
  totiter = 16
  traniter = 0
  tranpoints = 0
  accept = 0
  rejected = 0
  matrix size = 63
  fillins = 52
  solver = Normal
  Matrix Compiler1: 328 opcodes
  Matrix Compiler2: 5.85 KB object code size
- Circuit: * C:\Workspace\Git\BASIC_MRI_RFPA\LTSPICE simulations\RFPA_IRF630_pushpullx2_tran_param.asc
  
  Direct Newton iteration for .op point succeeded.
  
  pep: 50=(33.9794dB,0°)
  vd: 48=(33.6248dB,0°)
  vdmin: 12=(21.5836dB,0°)
  rload_lv_se_target: 12.96=(22.2521dB,0°)
  rload_lv_se: 12.96=(22.2521dB,0°)
  idmin: 0.5=(-6.0206dB,0°)
  id: 3.27777777777778=(10.3116dB,0°)
  gm0: 3.54=(10.9801dB,0°)
  gm: 1=(0dB,0°)
  rs: 0.717514124293785=(-2.88339dB,0°)
  rgbias: 100=(40dB,0°)
  rsource_lv_se: 12.5=(21.9382dB,0°)
  rfb: 145.848888888889=(43.2781dB,0°)
  cfb: 2.13967197033242e-009=(-173.393dB,0°)
  csource: 2.49655023567746e-008=(-152.053dB,0°)
  rin_lv_se: 10.2140455990304=(20.184dB,0°)
  vg: 7.77185185185185=(17.8105dB,0°)
  coss: 2.4e-010=(-192.396dB,0°)
  ld: 4.05778846306067e-006=(-107.834dB,0°)
  kin_lp: 0.00016=(-75.9176dB,0°)
  kin_ls: 1e-005=(-100dB,0°)
  kout_lp: 1e-005=(-100dB,0°)
  kout_ls: 0.00016=(-75.9176dB,0°)
  rload_hv_se: 51.84=(34.2933dB,0°)
  rsource_hv_se: 50=(33.9794dB,0°)
  atten_vout: 0.707945784384138=(-3dB,0°)
  atten_rshunt_in: 73.1005449100671=(37.2784dB,0°)
  atten_rshunt_out: 73.1005449100669=(37.2784dB,0°)
  atten_rser: 4.40369850149135=(12.8764dB,0°)
  f0: 5100000=(134.151dB,0°)
  s21_at_f0: mag(s21(v2))=(16.4268dB,0°) at 5.1e+006
  s11_at_f0: mag(s11(v2))=(-26.1036dB,0°) at 5.1e+006
  s22_at_f0: mag(s22(v2))=(-17.0016dB,0°) at 5.1e+006
  kstab_at_f0: kstab(s11(v2),s21(v2),s12(v2),s22(v2))=(4.64826dB,0°) at 5.1e+006
  zin_at_f0: mag(zin(v2))=(33.3467dB,0°) at 5.1e+006
  zout_at_f0: mag(zout(v2))=(32.5111dB,0°) at 5.1e+006
  s21_at_s21_max: MAX(mag(s21(v2)))=(17.508dB,0°) FROM 100000 TO 2e+008
  f_at_s21_max: mag(s21(v2))=(s21_at_s21_max) AT 1.30317e+006
  kstab_at_stab_min: MIN(kstab(s11(v2),s21(v2),s12(v2),s22(v2)))=(3.62582dB,0°) FROM 100000 TO 2e+008
  f_at_kstab_min: kstab(s11(v2),s21(v2),s12(v2),s22(v2))=(kstab_at_stab_min) AT 1.53109e+006

## Library data of the parts
C101 C102 C108-C111 C205-C208 = MDT_C:C; BOM: EXCLUDE; PACKAGE: 0805; VOLTAGE: 50V
C103-C107 C114 C115 C201-C204 C211 C212 C304 = MDT_C:C; BOM: INCLUDE; PACKAGE: 0805; VOLTAGE: 50V
C112 C113 C209 C210 = MDT_C:C; BOM: INCLUDE; PACKAGE: 1206; VOLTAGE: 100V
C116 C117 = MDT_C:C; BOM: EXCLUDE; PACKAGE: 1812; VOLTAGE: 100V
C118 C119 = MDT_C:C; BOM: EXCLUDE; PACKAGE: 1812; VOLTAGE: 250V
C120 = MDT_C:C; BOM: INCLUDE; PACKAGE: 1812; VOLTAGE: 250V
C301 C305 C306 = MDT_C:C; BOM: INCLUDE; PACKAGE: 0805; VOLTAGE: 25V
C302 C303 = MDT_C:C; BOM: EXCLUDE; PACKAGE: 0805; VOLTAGE: 25V
C401 = MDT_C:CPOL; BOM: INCLUDE; DIALECTRIC: ELEC; PARTNO: MAL225638332E3; SIZE: 25DX37L; TOL: +/-20%; VENDOR: Vishay; VOLTAGE: 63V
C402 C405 C408 C411-C413 = MDT_C:C; BOM: INCLUDE; DIALECTRIC: X7S; PACKAGE: 2220; PARTNO: CGA9N3X7S2A106M230KE; TOL: 20%; VOLTAGE: 100V
C403 C404 = MDT_C:C; BOM: INCLUDE; DIALECTRIC: X7S; PACKAGE: 1210; VOLTAGE: 50V
C406 C407 = MDT_C:C; BOM: INCLUDE; DIALECTRIC: X7R; PACKAGE: 1206; VOLTAGE: 50V
C409 C410 = MDT_C:CPOL; BOM: INCLUDE; DIALECTRIC: ELEC; PARTNO: 860010773010; SIZE: 6.3DX12.5L; TOL: +/-20%; VENDOR: Wurth; VOLTAGE: 63V
D401 = MDT_Diode:D-SCHOTTKY; BOM: INCLUDE; CURRENT: 8A; DEVICE: SK810L-TP; PACKAGE: SMC; PARTNO: SK810L-TP; VOLTAGE: 100V
D402 = MDT_Diode:D-ZENER; BOM: INCLUDE; DEVICE: 1N5355B-TP; PACKAGE: DO-15; PARTNO: 1N5355B-TP; POWER: 5W; VOLTAGE: 18V
H401-H404 = holes:MOUNT-PAD-SQUARE: MOUNTING PAD, square; BOM: EXCLUDE
J1 = MDT_CON:HDR_2X1; BOM: INCLUDE; DESCRIPTION: TERM BLK 2POS SIDE ENTRY 5MM PCB; PARTNO: 282836-1; PINS: 2x1; VENDOR: TE
J101 J102 J301 J302 = MDT_CON:COAX; BOM: INCLUDE; DESCRIPTION: CONN BNC JACK STR 50OHM EDGE MNT; PARTNO: 112640; VENDOR: Amphenol
J401 = MDT_FUSE:FUSE_2P; BOM: INCLUDE; PARTNO: 02540121Z
J402 = MDT_CON:KK_PCFAN; BOM: INCLUDE; PARTNO: 47053-1000
JP301 JP302 = pinhead:PINHD-1X2: PIN HEADER
L101 L102 L201 L202 = MDT_L:L_CHIP; BOM: INCLUDE; CORE: AIR; DCR: 0.16; IDC: 1A; PACKAGE: 1008; PARTNO: 1008CS-470XJLC; TOL: 5%
L103 L104 L401 = MDT_L:L; BOM: INCLUDE; CURRENT: 10.5A; DEVICE: DR127-3R3-R; ESR: 5.67m; PARTNO: DR127-3R3-R; TOL: 20%
L402 = MDT_L:L; BOM: INCLUDE; CURRENT: 4.0A; DEVICE: DR127-220-R; ESR: 39.1m; PARTNO: DR127-220-R; TOL: 20%
LED301 = MDT_Diode:LED; BOM: INCLUDE; BRIGHTNESS: 5.7mcd; COLOR: YELLOW; CURRENT: 10mA; PACKAGE: T-1 3/4; PARTNO: HLMP-3401-E0002; VENDOR: BROADCOM
LED401 LED402 = MDT_Diode:LED; BOM: INCLUDE; BRIGHTNESS: 10.6mcd; COLOR: GREEN; CURRENT: 10mA; PACKAGE: T-1 3/4; PARTNO: HLMP-3962-F0002; VENDOR: BROADCOM
Q101 Q102 Q201 Q202 = MDT_TRANS:MOSFET_N; BOM: INCLUDE; CURRENT: 9A; DESCRIPTION: MOSFET N-CH 200V 9A TO220AB; DEVICE: IRF630; PACKAGE: TO-220; PARTNO: IRF630; VENDOR: STM; VOLTAGE: 200V
Q301 = MDT_TRANS:MOSFET_N; BOM: INCLUDE; CURRENT: 0.17A; DESCRIPTION: MOSFET N-CH 100V 170MA SOT23-3; DEVICE: BSS123; PACKAGE: SOT23-3; PARTNO: BSS123-7-F; VENDOR: Diodes Inc; VOLTAGE: 100V
Q302 = MDT_TRANS:PNP; BOM: INCLUDE; CURRENT: 0.2A; DESCRIPTION: TRANS PNP 40V 200MA TO236AB; DEVICE: MMBT3906; PACKAGE: SOT23-3; PARTNO: PMBT3906,215; VENDOR: Nexperia; VOLTAGE: 40V
Q303 = MDT_TRANS:NPN; BOM: INCLUDE; CURRENT: 0.2A; DESCRIPTION: TRANS NPN 40V 200MA TO236AB; DEVICE: MMBT3904; PACKAGE: SOT23-3; PARTNO: MMBT3904,215; VENDOR: Nexperia; VOLTAGE: 40V
R101 R108 R110 R132 R207 R209 R307 R309 R314 R406 R407 = MDT_R:R; BOM: INCLUDE; PACKAGE: 0805
R102 R103 R106 R107 R109 R111 R201 R202 R205 R206 R208 R210 = MDT_R:R; BOM: INCLUDE; PACKAGE: 1206
R104 R105 R203 R204 R402-R405 = MDT_R:R90; BOM: INCLUDE; PACKAGE: 1206
R112 R113 R116 R117 R211 R212 R215 R216 R311 = MDT_R:R; BOM: EXCLUDE; PACKAGE: 0805
R114 R115 R130 R131 R213 R214 R229 R230 R302-R306 R308 R310 R312 R315-R317 R408 = MDT_R:R90; BOM: INCLUDE; PACKAGE: 0805
R118-R121 R217-R220 = MDT_R:R90; BOM: INCLUDE; PACKAGE: 2512
R122-R129 R221-R228 = MDT_R:R; BOM: INCLUDE; PACKAGE: 2512
R301 = MDT_R:RTRIM; BOM: INCLUDE; PARTNO: 3299W-1-103LF; POWER: 0.5W; TOL: 10%; VENDOR: Bourns
R313 = MDT_R:R90; BOM: EXCLUDE; PACKAGE: 0805
R401 = MDT_R:R90; BOM: INCLUDE; PACKAGE: AXIAL; PARTNO: PAC300001008FAC000; POWER: 3W; TOL: 1%; VENDOR: Vishay
T101 T102 = MDT_TRAFO:HP4_TRAFO; BOM: INCLUDE; CURRENT: 1.88A; ISAT: 1A; PARTNO: HP4-0140LB; RATIO: 1:1:1:1:1:1
TP1-TP19 = MDT_CON:PROBE_TP; BOM: EXCLUDE
U301 = 74xx-little-us:74*1G14: Single Schmitt-Trigger Inverter Gate; BOM: INCLUDE; DESCRIPTION: IC INVERT SCHMITT 1CH 1-IN SOT25; PACKAGE: SOT23-5; PARTNO: 74AHC1G14QW5-7; VENDOR: Diodes Inc
U302 = MDT_IC:OPAMP_QUAD; BOM: INCLUDE; DESCRIPTION: IC OPAMP GP 4 CIRCUIT 14SOIC; PARTNO: TLV274ID; VENDOR: Texas Instruments
U401 = MDT_IC:LDO_3TERM; BOM: INCLUDE; DESCRIPTION: IC REG LINEAR 12V 500MA TO220AB; PACKAGE: TO220; PARTNO: MC78M12CTG; VENDOR: ONSEMI
U402 = MDT_IC:LDO_3TERM; BOM: INCLUDE; DESCRIPTION: IC REG LINEAR 5V 500MA TO220AB; PACKAGE: TO220; PARTNO: MC78M05CTG; VENDOR: ONSEMI
X402 = MDT_HEATSINK:HEATSINK_OMNI_DUAL; BOM: INCLUDE; PARTNO: OMNI-UNI-30-75-D; VENDOR: Wakefield-Vette

## Net classes
1 32W_20S: width 0.813 mm, drill 0.6 mm, clearance 0.508 mm
2 32W_30S: width 0.813 mm, drill 0.6 mm, clearance 0.762 mm
3 50W_30S: width 1.27 mm, drill 0.6 mm, clearance 0.762 mm